# EAGLE design T4p0_cutout (EAGLE 9.6.2)
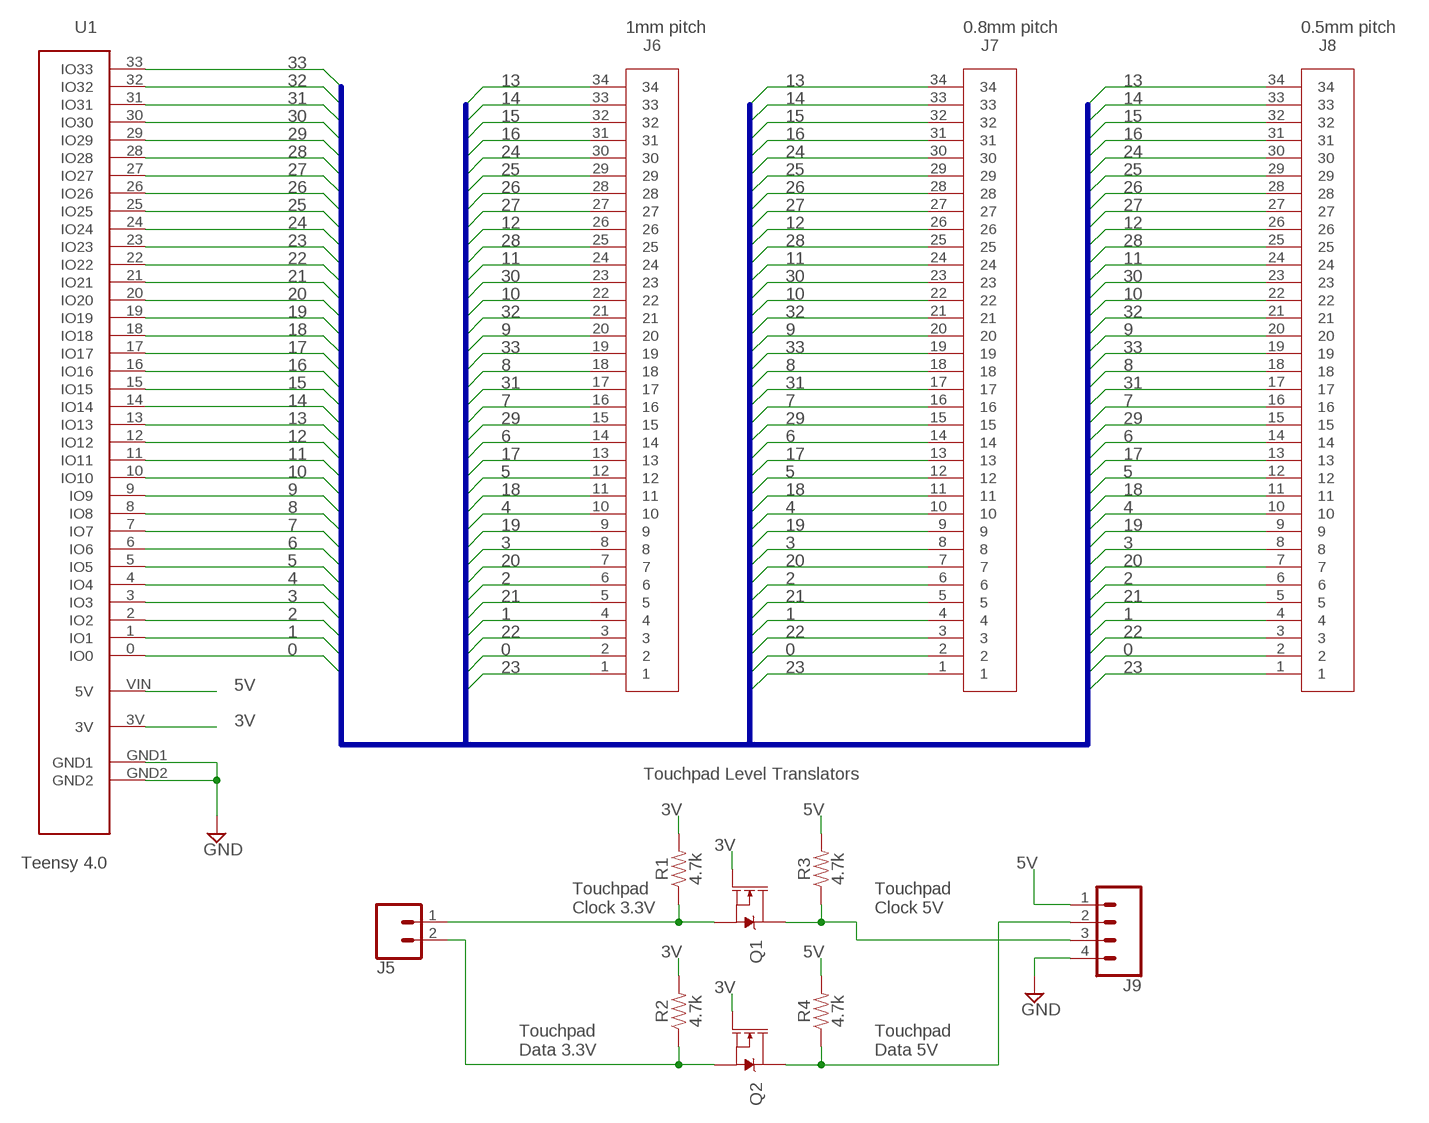
[diagram p0: schematic, sheet 1]

## Parts
J5  CONN_021X02_NO_SILK  [1X02_NO_SILK]
J6  FPC34  [FPC34]
J7  FPC34_P8MM  [FPC34_P8MM]
J8  FPC34_P5MM  [FPC34_P5MM]
J9  CONN_041X04_NO_SILK  [1X04_NO_SILK]
Q1  220mA/50V/3.5Ω  MOSFET-NCH-BSS138  [SOT23-3]
Q2  220mA/50V/3.5Ω  MOSFET-NCH-BSS138  [SOT23-3]
R1  4.7k  4.7KOHM-0603-1/10W-1%  [0603]
R2  4.7k  4.7KOHM-0603-1/10W-1%  [0603]
R3  4.7k  4.7KOHM-0603-1/10W-1%  [0603]
R4  4.7k  4.7KOHM-0603-1/10W-1%  [0603]
U1  TEENSY4P0_CUTOUT  [TEENSY4P0_CUTOUT]

## Nets
0: J6.2 J7.2 J8.2 U1.0(IO0)
1: J6.4 J7.4 J8.4 U1.1(IO1)
2: J6.6 J7.6 J8.6 U1.2(IO2)
3: J6.8 J7.8 J8.8 U1.3(IO3)
3V: Q1.1(G) Q2.1(G) R1.2 R2.2 U1.3V
4: J6.10 J7.10 J8.10 U1.4(IO4)
5: J6.12 J7.12 J8.12 U1.5(IO5)
5V: J9.1 R3.2 R4.2 U1.VIN(5V)
6: J6.14 J7.14 J8.14 U1.6(IO6)
7: J6.16 J7.16 J8.16 U1.7(IO7)
8: J6.18 J7.18 J8.18 U1.8(IO8)
9: J6.20 J7.20 J8.20 U1.9(IO9)
10: J6.22 J7.22 J8.22 U1.10(IO10)
11: J6.24 J7.24 J8.24 U1.11(IO11)
12: J6.26 J7.26 J8.26 U1.12(IO12)
13: J6.34 J7.34 J8.34 U1.13(IO13)
14: J6.33 J7.33 J8.33 U1.14(IO14)
15: J6.32 J7.32 J8.32 U1.15(IO15)
16: J6.31 J7.31 J8.31 U1.16(IO16)
17: J6.13 J7.13 J8.13 U1.17(IO17)
18: J6.11 J7.11 J8.11 U1.18(IO18)
19: J6.9 J7.9 J8.9 U1.19(IO19)
20: J6.7 J7.7 J8.7 U1.20(IO20)
21: J6.5 J7.5 J8.5 U1.21(IO21)
22: J6.3 J7.3 J8.3 U1.22(IO22)
23: J6.1 J7.1 J8.1 U1.23(IO23)
24: J6.30 J7.30 J8.30 U1.24(IO24)
25: J6.29 J7.29 J8.29 U1.25(IO25)
26: J6.28 J7.28 J8.28 U1.26(IO26)
27: J6.27 J7.27 J8.27 U1.27(IO27)
28: J6.25 J7.25 J8.25 U1.28(IO28)
29: J6.15 J7.15 J8.15 U1.29(IO29)
30: J6.23 J7.23 J8.23 U1.30(IO30)
31: J6.17 J7.17 J8.17 U1.31(IO31)
32: J6.21 J7.21 J8.21 U1.32(IO32)
33: J6.19 J7.19 J8.19 U1.33(IO33)
CLK3V: J5.1 Q1.2(S) R1.1
CLK5V: J9.3 Q1.3(D) R3.1
DATA3V: J5.2 Q2.2(S) R2.1
DATA5V: J9.2 Q2.3(D) R4.1
GND: J9.4 U1.GND1 U1.GND2

## Buses
IO:0,1,2,3,4,5,6,7,8,9,10,11,12,13,14,15,16,17,18,19,20,21,22,23,24,25,26,27,28,29,30,31,32,33,TPCLK,TPDATA

## Notes on the sheet
- 1mm pitch | 0.8mm pitch | 0.5mm pitch
- Touchpad Level Translators
- Teensy 4.0
- Touchpad
  Clock 3.3V
- Touchpad
  Clock 5V
- Touchpad
  Data 3.3V
- Touchpad
  Data 5V

## Library data of the parts
J5 = SparkFun-Connectors:CONN_02: Multi connection point. Often used as Generic Header-pin footprint for 0.1 inch spaced/style header connections On any of the 0.1 inch spaced packages, you can populate with these: Break Away Headers - Straight <https://www.sparkfun.com/products/116> (PRT-00116) Break Away Male Headers - Right Angle <https://www.sparkfun.com/products/553> (PRT-00553) Female Headers <https://www.sparkfun.com/products/115> (PRT-00115) Break Away Headers - Machine Pin <https://www.sparkfun.com/products/117> (PRT-00117) Break Away Female Headers - Swiss Machine Pin <https://www.sparkfun.com/products/743> (PRT-00743) For SCREWTERMINALS and SPRING TERMINALS visit here: Screw Terimnals on SparkFun.com <https://www.sparkfun.com/search/results?term=Screw+Terminals> (5mm/3.5mm/2.54mm spacing) This device is also useful as a general connection point to wire up your design to another part of your project. Our various solder wires solder well into these plated through hole pads. Hook-Up Wire - Assortment (Stranded, 22 AWG) <https://www.sparkfun.com/products/11375> (PRT-11375) Hook-Up Wire - Assortment (Solid Core, 22 AWG) <https://www.sparkfun.com/products/11367> (PRT-11367) View the entire wire category on our website here <https://www.sparkfun.com/categories/141> Special notes: Molex polarized connector foot print use with: PRT-08233 with associated crimp pins and housings. 2.54_SCREWTERM for use with PRT-10571. 3.5mm Screw Terminal footprints for PRT-08084 5mm Screw Terminal footprints for use with PRT-08432
J6 = FPC34:FPC34: Molex Right Angle FPC Connector 1mm pitch, bottom contacts with 32 pins. Molex Part Number DigiKey Part Number
J7 = FPC34_p8mm:FPC34_P8MM: Molex Right Angle FPC Connector 1mm pitch, bottom contacts with 32 pins. Molex Part Number DigiKey Part Number
J8 = FPC34_p5mm:FPC34_P5MM: Molex Right Angle FPC Connector 1mm pitch, bottom contacts with 32 pins. Molex Part Number DigiKey Part Number
J9 = SparkFun-Connectors:CONN_04: Multi connection point. Often used as Generic Header-pin footprint for 0.1 inch spaced/style header connections On any of the 0.1 inch spaced packages, you can populate with these: Break Away Headers - Straight <https://www.sparkfun.com/products/116> (PRT-00116) Break Away Male Headers - Right Angle <https://www.sparkfun.com/products/553> (PRT-00553) Female Headers <https://www.sparkfun.com/products/115> (PRT-00115) Break Away Headers - Machine Pin <https://www.sparkfun.com/products/117> (PRT-00117) Break Away Female Headers - Swiss Machine Pin <https://www.sparkfun.com/products/743> (PRT-00743) For SCREWTERMINALS and SPRING TERMINALS visit here: Screw Terimnals on SparkFun.com <https://www.sparkfun.com/search/results?term=Screw+Terminals> (5mm/3.5mm/2.54mm spacing) This device is also useful as a general connection point to wire up your design to another part of your project. Our various solder wires solder well into these plated through hole pads. Hook-Up Wire - Assortment (Stranded, 22 AWG) <https://www.sparkfun.com/products/11375> (PRT-11375) Hook-Up Wire - Assortment (Solid Core, 22 AWG) <https://www.sparkfun.com/products/11367> (PRT-11367) View the entire wire category on our website here <https://www.sparkfun.com/categories/141> Special notes: Molex polarized connector foot print use with SKU : PRT-08231 with associated crimp pins and housings. 1MM SMD Version SKU: PRT-10208; PROD_ID: CONN-09696
Q1 Q2 = SparkFun-DiscreteSemi:MOSFET-NCH: N-channel MOSFETs Voltage controlled devices that allow control of high current outputs. SparkFun Products: SparkFun OpenScale <https://www.sparkfun.com/products/13261> SparkFun Digital Sandbox <https://www.sparkfun.com/products/12651> SparkFun Monster Moto Shield <https://www.sparkfun.com/products/10182> SparkFun MOSFET Power Controller <https://www.sparkfun.com/products/11214>; PROD_ID: TRANS-00830
R1-R4 = SparkFun-Resistors:4.7KOHM: 4.7kΩ resistor A resistor is a passive two-terminal electrical component that implements electrical resistance as a circuit element. Resistors act to reduce current flow, and, at the same time, act to lower voltage levels within circuits. - Wikipedia; PROD_ID: RES-07857
U1 = TEENSY4P0_CUTOUT:TEENSY4P0_CUTOUT

## Board
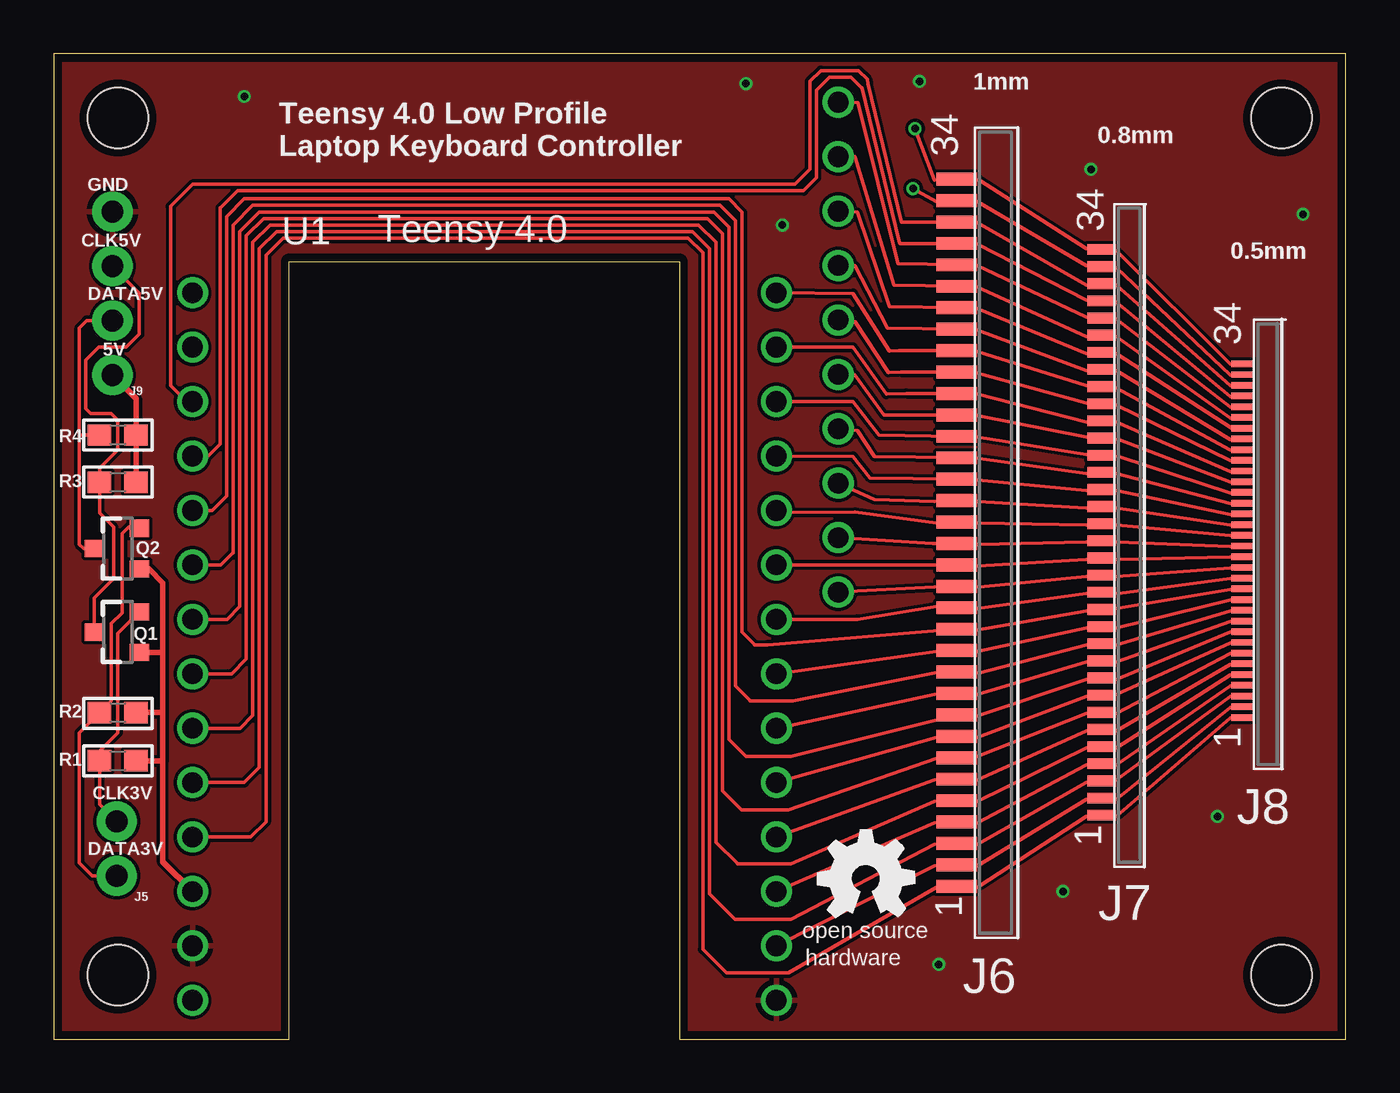
[diagram p1: board, top side]
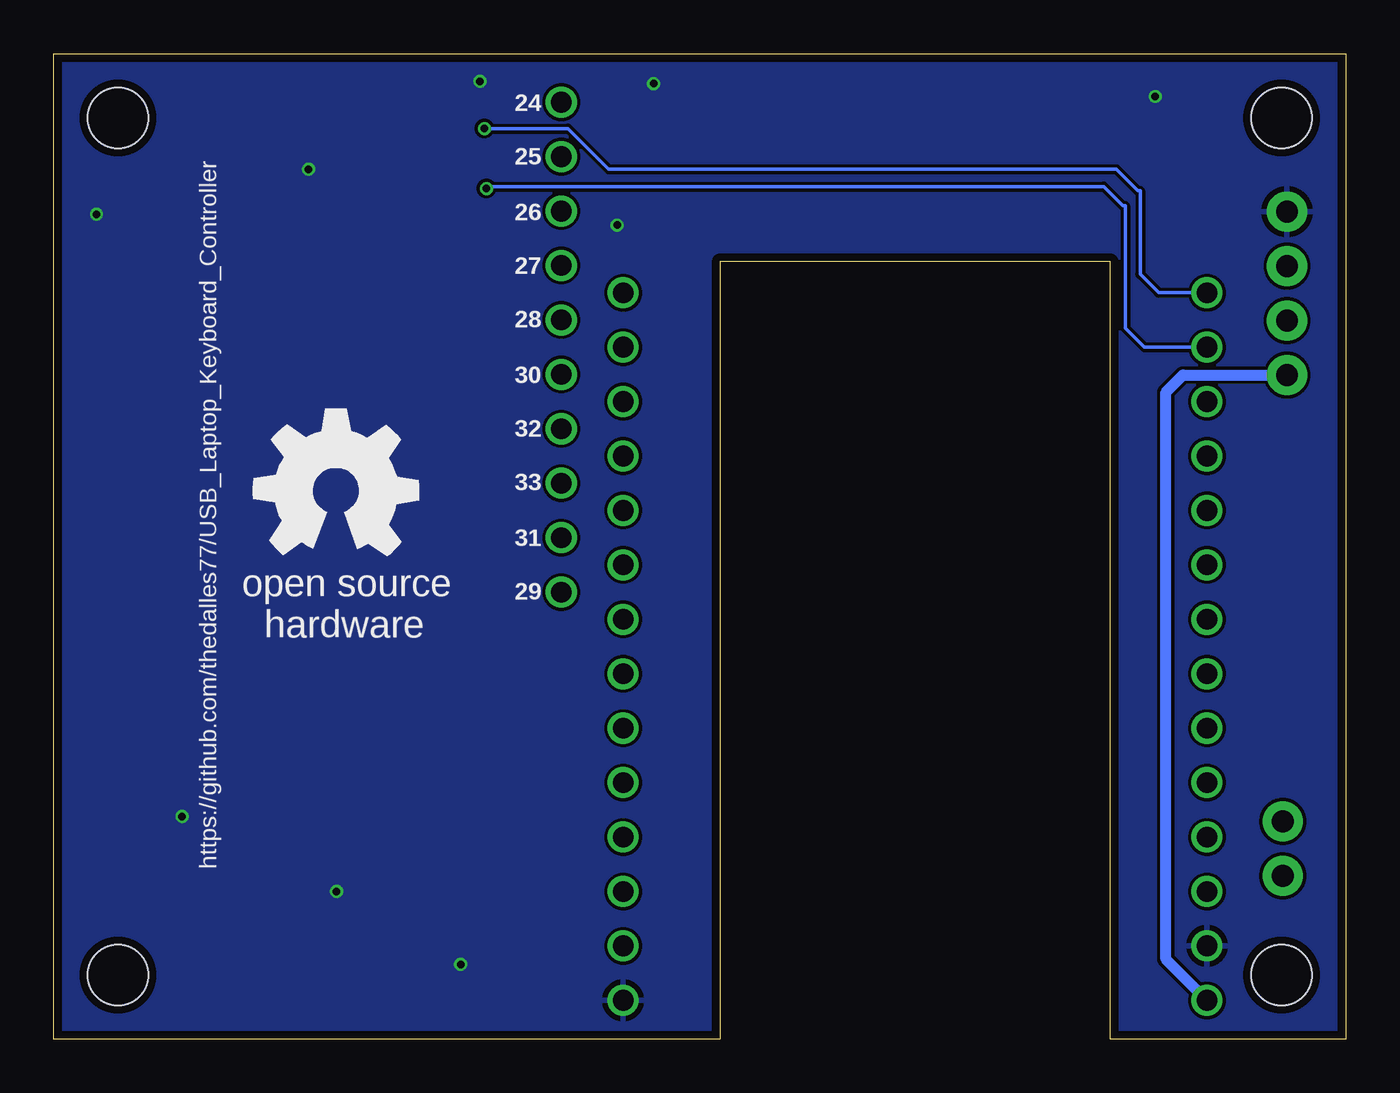
[diagram p2: board, bottom side, seen from below]

Size 60.3 x 46 mm. Coordinates in mm from the lower left corner, seen from the top.
Outline: 0,0 11,0 11,36.3 29.2,36.3 29.2,0 60.3,0 60.3,46 0,46 0,0
Copper layers (1*16): Top 0.035559375mm / dielectric 1.6mm / Bottom 0.035559375mm
Design rules "oshpark-2layer": minimum track width 6mil, minimum drill 10mil, track to track 6mil, track to pad 6mil, pad to pad 6mil, via to via 6mil, smd to smd 6mil, copper to edge 15mil, drill to drill 6mil, minimum pad ring 5mil, minimum via ring 5mil, stop-mask expansion 2.5mil, vias tented up to drill 0mil, thermal gap 10mil
Holes 2.8 mm at 3,3 3,43 57.3,3 57.3,43

### Footprints (pad centres in the part's own frame; a part is rotated, then mirrored left to right if it is on the bottom)
1X02_NO_SILK = drill 1.016 pad 1.88: 1 0,0; 2 2.54,0
FPC34 = smd 0.6 x 1.9: 1 -13.7,3.86; 2 -12.7,3.86; 3 -11.7,3.86; 4 -10.7,3.86; 5 -9.7,3.86; 6 -8.7,3.86; 7 -7.7,3.86; 8 -6.7,3.86; 9 -5.7,3.86; 10 -4.7,3.86; 11 -3.7,3.86; 12 -2.7,3.86; 13 -1.7,3.86; 14 -0.7,3.86; 15 0.3,3.86; 16 1.3,3.86; 17 2.3,3.86; 18 3.3,3.86; 19 4.3,3.86; 20 5.3,3.86; 21 6.3,3.86; 22 7.3,3.86; 23 8.3,3.86; 24 9.3,3.86; 25 10.3,3.86; 26 11.3,3.86; 27 12.3,3.86; 28 13.3,3.86; 29 14.3,3.86; 30 15.3,3.86; 31 16.3,3.86; 32 17.3,3.86; 33 18.3,3.86; 34 19.3,3.86
FPC34_P8MM = smd 0.5 x 1.35: 1 -13.7,3.6; 2 -12.9,3.6; 3 -12.1,3.6; 4 -11.3,3.6; 5 -10.5,3.6; 6 -9.7,3.6; 7 -8.9,3.6; 8 -8.1,3.6; 9 -7.3,3.6; 10 -6.5,3.6; 11 -5.7,3.6; 12 -4.9,3.6; 13 -4.1,3.6; 14 -3.3,3.6; 15 -2.5,3.6; 16 -1.7,3.6; 17 -0.9,3.6; 18 -0.1,3.6; 19 0.7,3.6; 20 1.5,3.6; 21 2.3,3.6; 22 3.1,3.6; 23 3.9,3.6; 24 4.7,3.6; 25 5.5,3.6; 26 6.3,3.6; 27 7.1,3.6; 28 7.9,3.6; 29 8.7,3.6; 30 9.5,3.6; 31 10.3,3.6; 32 11.1,3.6; 33 11.9,3.6; 34 12.7,3.6
FPC34_P5MM = smd 0.3 x 1.1: 1 -13.7,3.5; 2 -13.2,3.5; 3 -12.7,3.5; 4 -12.2,3.5; 5 -11.7,3.5; 6 -11.2,3.5; 7 -10.7,3.5; 8 -10.2,3.5; 9 -9.7,3.5; 10 -9.2,3.5; 11 -8.7,3.5; 12 -8.2,3.5; 13 -7.7,3.5; 14 -7.2,3.5; 15 -6.7,3.5; 16 -6.2,3.5; 17 -5.7,3.5; 18 -5.2,3.5; 19 -4.7,3.5; 20 -4.2,3.5; 21 -3.7,3.5; 22 -3.2,3.5; 23 -2.7,3.5; 24 -2.2,3.5; 25 -1.7,3.5; 26 -1.2,3.5; 27 -0.7,3.5; 28 -0.2,3.5; 29 0.3,3.5; 30 0.8,3.5; 31 1.3,3.5; 32 1.8,3.5; 33 2.3,3.5; 34 2.8,3.5
1X04_NO_SILK = drill 1.016 pad 1.88: 1 0,0; 2 2.54,0; 3 5.08,0; 4 7.62,0
SOT23-3 = smd 0.8 x 0.9: 1 -0.95,-1; 2 0.95,-1; 3 0,1.1
0603 = smd 1.1 x 1: 1 -0.85,0; 2 0.85,0
TEENSY4P0_CUTOUT = drill 0.965: 0 -15.24,-13.62; 1 -12.7,-13.62; 2 -10.16,-13.62; 3 -7.62,-13.62; 3V -12.7,13.62; 4 -5.08,-13.62; 5 -2.54,-13.62; 6 0,-13.62; 7 2.54,-13.62; 8 5.08,-13.62; 9 7.62,-13.62; 10 10.16,-13.62; 11 12.7,-13.62; 12 15.24,-13.62; 13 15.24,13.62; 14 12.7,13.62; 15 10.16,13.62; 16 7.62,13.62; 17 5.08,13.62; 18 2.54,13.62; 19 0,13.62; 20 -2.54,13.62; 21 -5.08,13.62; 22 -7.62,13.62; 23 -10.16,13.62; 24 24.13,-16.51; 25 21.59,-16.51; 26 19.05,-16.51; 27 16.51,-16.51; 28 13.97,-16.51; 29 1.27,-16.51; 30 11.43,-16.51; 31 3.81,-16.51; 32 8.89,-16.51; 33 6.35,-16.51; GND1 -17.78,-13.62; GND2 -15.24,13.62; VIN -17.78,13.62

### Placement (x,y rotation side)
J5  2.95,10.17 270 top
J6  46,20.84 90 top
J7  52.5,24.16 90 top
J8  59,28.72 90 top
J9  2.75,31 90 top
Q1  3,19 90 top
Q2  3,22.9 90 top
R1  3,13 0 top
R2  3,15.25 0 top
R3  3,26 0 top
R4  3,28.2 0 top
U1  20.1,19.6 90 top
U$1  [OSHW_5MM]  37.9,7.5 0 top
U$2  [OSHW_8MM]  47.1,25.6 0 top

### Tracks (layer width: path | path; a pad name or v marks a point on that pad's centre or on a via)
0
  Top 0.152: U1.0 41.1,8.1 J6.2 43.1,8.1 48.2,11.2 J7.2 49.6,11.2 54.9,15.5 J8.2
1
  Top 0.152: U1.1 41.1,10.1 J6.4 43.1,10.1 48.2,12.8 J7.4 49.6,12.8 54.9,16.5 J8.4
2
  Top 0.152: U1.2 41.1,12.1 J6.6 43.1,12.1 48.2,14.4 J7.6 49.6,14.4 54.9,17.5 J8.6
3
  Top 0.152: U1.3 41.2,14.1 J6.8 43.1,14.1 48.2,16 J7.8 49.6,16.1 54.9,18.5 J8.8
3V
  Top 0.254: Q2.1 4.45,21.95 5.1,21.3 5.1,18 | 5.1,18 5.1,15.2 | 5.1,15.2 5.1,13 | R2.2 5.05,15.25 5.1,15.2 | Q1.1 5.05,18.05 5.1,18 | U1.3V 5.1,8.28 5.1,13 | R1.2 5.1,13
4
  Top 0.152: U1.4 41.1,16.1 J6.10 43.1,16.1 48.2,17.6 J7.10 49.6,17.6 54.9,19.5 J8.10
5
  Top 0.152: U1.5 41.2,18.1 J6.12 43.1,18.1 48.2,19.2 J7.12 49.6,19.2 54.9,20.5 J8.12
5V
  Top 0.254: J9.1 3.85,29.9 R4.2 R3.2
  Bottom 0.508: U1.VIN 8.4,3.74 8.4,30.2 7.6,31 J9.1
6
  Top 0.152: U1.6 37.5,19.6 41.2,20.2 J6.14 43.1,20.1 48.2,20.8 J7.14 49.7,20.8 54.9,21.5 J8.14
7
  Top 0.152: U1.7 J6.16 43.1,22.1 48.2,22.4 J7.16 49.6,22.4 54.9,22.5 J8.16
8
  Top 0.152: U1.8 33.82,24.58 37.4,24.6 41.2,24.1 J6.18 43.1,24.1 48.2,24 J7.18 49.6,24 54.9,23.5 J8.18
9
  Top 0.152: U1.9 37.3,27.2 38.1,26.2 42.1,26.14 | 42.1,26.14 J6.20 | 42.1,26.14 43.1,26.1 48.2,25.6 J7.20 49.6,25.6 54.9,24.5 J8.20
10
  Top 0.152: U1.10 37.3,29.76 38.5,28.2 J6.22 43.1,28.1 48.2,27.3 J7.22 49.7,27.2 54.9,25.5 J8.22
11
  Top 0.152: U1.11 37.3,32.3 38.86,30.1 39.79,30.14 J6.24 43.1,30.1 48.2,28.8 J7.24 49.6,28.8 54.9,26.5 J8.24
12
  Top 0.152: U1.12 37.3,34.8 38.99,32.12 39.44,32.14 J6.26 43.1,32.1 48.2,30.5 J7.26 49.6,30.4 54.9,27.5 J8.26
13  (via drill 0.35)
  Top 0.152: v40.2,42.5 41.1,40.1 J6.34 43.2,40.1 48.2,36.9 J7.34 49.6,36.8 54.9,31.5 J8.34
  Bottom 0.152: v40.2,42.5 36.3,42.5 34.4,40.6 10.7,40.6 9.7,39.6 9.6,39.6 9.6,35.7 8.74,34.84 U1.13
14  (via drill 0.35)
  Top 0.152: v40.1,39.7 41.2,39.1 J6.33 43.1,39.1 48.2,36.1 J7.33 49.6,36 54.9,31 J8.33
  Bottom 0.152: U1.14 9.4,32.3 10.3,33.2 10.3,38.9 10.4,38.9 11.3,39.8 40.1,39.8 v40.1,39.7
15
  Top 0.152: J8.32 54.9,30.5 49.6,35.2 J7.32 48.2,35.2 43.1,38.1 J6.32 39.55,38.14 38,44.6 37.97,44.8 37.56,45.2 35.79,45.2 35.29,44.7 35.29,40.6 34.59,39.91 6.5,39.91 5.46,38.87 5.46,30.5 6.2,29.76 U1.15
16
  Top 0.152: J8.31 54.9,30 49.6,34.4 J7.31 48.2,34.5 43.1,37.1 J6.31 39.5,37.14 39.47,37.17 37.72,44.41 37.7,44.41 37.2,44.9 36.19,44.9 35.59,44.3 35.59,40.2 34.99,39.6 8.6,39.6 7.8,38.8 7.77,38.8 7.77,27.77 7.2,27.2 7.18,27.22 U1.16
17
  Top 0.152: U1.17 7.4,24.68 8.08,25.36 8.08,38.4 8.9,39.22 31.5,39.22 32.12,38.6 32.12,19 32.7,18.42 32.7,18.4 33.31,18.4 J6.13 43.1,19.1 48.2,20 J7.13 49.6,20.1 54.9,21 J8.13
18
  Top 0.152: U1.18 7.8,22.14 8.36,22.7 8.38,22.7 8.38,38 9.3,38.92 31.1,38.92 31.82,38.2 31.82,16.5 32.5,15.82 32.5,15.8 34.5,15.8 41.1,17.1 J6.11 43.2,17.1 48.2,18.4 J7.11 49.6,18.4 54.9,20 J8.11
19
  Top 0.152: U1.19 8.1,19.6 8.69,20.19 8.69,37.7 9.6,38.61 30.8,38.61 31.51,37.9 31.51,14 32.3,13.21 32.3,13.2 34.4,13.2 J6.9 43.1,15.1 48.2,16.8 J7.9 49.6,16.8 54.9,19 J8.9
20
  Top 0.152: U1.20 8.3,17.06 8.99,17.75 8.99,37.5 9.8,38.31 30.5,38.31 31.21,37.6 31.21,11.6 32.1,10.71 32.1,10.7 34.3,10.7 41.2,13.1 J6.7 43.1,13.2 48.2,15.2 J7.7 49.6,15.2 54.9,18 J8.7
21
  Top 0.152: U1.21 8.7,14.52 9.3,15.12 9.3,37.2 10.1,38 30.1,38 30.91,37.2 30.91,9.2 31.9,8.21 31.9,8.2 34.4,8.2 41.1,11.1 J6.5 43.1,11.1 48.2,13.6 J7.5 49.6,13.6 54.9,17 J8.5
22
  Top 0.152: U1.22 8.9,11.98 9.6,12.68 9.6,36.9 10.4,37.7 29.8,37.7 30.6,36.9 30.6,6.8 31.8,5.6 34.4,5.6 41.1,9.1 J6.3 43.1,9.1 48.2,12 J7.3 49.6,12.1 54.9,16 J8.3
23
  Top 0.152: U1.23 9.2,9.44 9.91,10.15 9.91,36.6 10.7,37.39 29.6,37.39 30.29,36.7 30.29,4.2 31.39,3.1 34.3,3.1 41.2,7.1 J6.1 43.1,7.1 48.2,10.4 J7.1 49.6,10.4 54.9,15 J8.1
24
  Top 0.152: U1.24 37.52,43.71 39.4,36.2 J6.30 43.1,36.1 48.2,33.7 J7.30 49.6,33.6 54.9,29.5 J8.30
25
  Top 0.152: U1.25 37.4,41.2 39.2,35.2 J6.29 43.1,35.1 48.2,32.8 J7.29 49.6,32.8 54.9,29 J8.29
26
  Top 0.152: U1.26 37.5,38.6 39,34.2 42.1,34.14 | 42.1,34.14 J6.28 | 42.1,34.14 43.1,34.1 48.2,32 J7.28 49.6,32 55,28.5 J8.28
27
  Top 0.152: U1.27 37.4,36.1 38.9,33.2 J6.27 43.1,33.1 48.2,31.2 J7.27 49.6,31.2 54.9,28 J8.27
28
  Top 0.152: U1.28 37.4,33.5 38.95,31.12 39.54,31.14 J6.25 43.1,31.1 48.2,29.7 J7.25 49.6,29.6 54.9,27 J8.25
29
  Top 0.152: U1.29 41.1,21.1 J6.15 43.2,21.1 48.2,21.6 J7.15 49.6,21.6 54.9,22 J8.15
30
  Top 0.152: U1.30 37.4,31 38.75,29.14 J6.23 43.1,29.1 48.2,28.1 J7.23 49.7,28 54.9,26 J8.23
31
  Top 0.152: U1.31 41.04,23.14 J6.17 43.1,23.1 48.2,23.2 J7.17 49.6,23.2 54.9,23 J8.17
32
  Top 0.152: U1.32 37.5,28.4 38.3,27.2 J6.21 43.2,27.1 48.2,26.4 J7.21 49.6,26.4 54.9,25 J8.21
33
  Top 0.152: U1.33 38.3,25.2 41.1,25.1 J6.19 43.1,25.1 48.2,24.8 J7.19 49.6,24.8 54.9,24 J8.19
CLK3V
  Top 0.152: Q1.2 3,18.95 3,14.3 2.15,13.45 R1.1 2.15,10.97 J5.1
CLK5V
  Top 0.152: Q1.3 1.9,20.6 2.8,21.5 2.8,23.9 2.15,24.55 R3.1 2.15,26.65 3,27.5 3,28.9 2.7,29.2 1.73,29.2 1.5,29.42 1.5,31.7 2.1,32.3 3.4,32.3 4,32.9 4,34.83 J9.3
DATA3V
  Top 0.152: J5.2 1.8,7.63 1.2,8.23 1.2,14.3 R2.1 2.69,15.79 2.69,19.39 3.2,19.9 3.2,23.6 3.5,23.9 3.55,23.85 Q2.2
DATA5V
  Top 0.152: Q2.3 1.4,22.9 1.2,23.1 1.2,28.2 | 1.2,28.2 1.2,33.2 1.54,33.54 J9.2 | R4.1 1.2,28.2
GND  (via drill 0.35)
  other vias: 41.3,3.5 54.3,10.4 58.3,38.5 40.4,44.7 32.3,44.6 34,38 8.9,44 48.4,40.6 47.1,6.9
  pour Top: 0,0 0,46 60.3,46 60.3,0 29.2,0 29.2,36.3 11,36.3 11,0
  pour Bottom: 0,0 0,46 60.3,46 60.3,0 29.2,0 29.2,36.3 11,36.3 11,0

### Text on the board
tPlace: 1mm | 0.8mm | Teensy 4.0 Low Profile / Laptop Keyboard Controller | 34 | GND | CLK5V | 34 | Teensy 4.0 | 0.5mm | DATA5V | 5V | 34 | CLK3V | DATA3V
bPlace: 24 | 25 | https://github.com/thedalles77/USB_Laptop_Keyboard_Controller | 26 | 27 | 28 | 30 | 32 | 33 | 31 | 29